# EAGLE design TwoMotorController 1.0 (EAGLE 6.6.0)
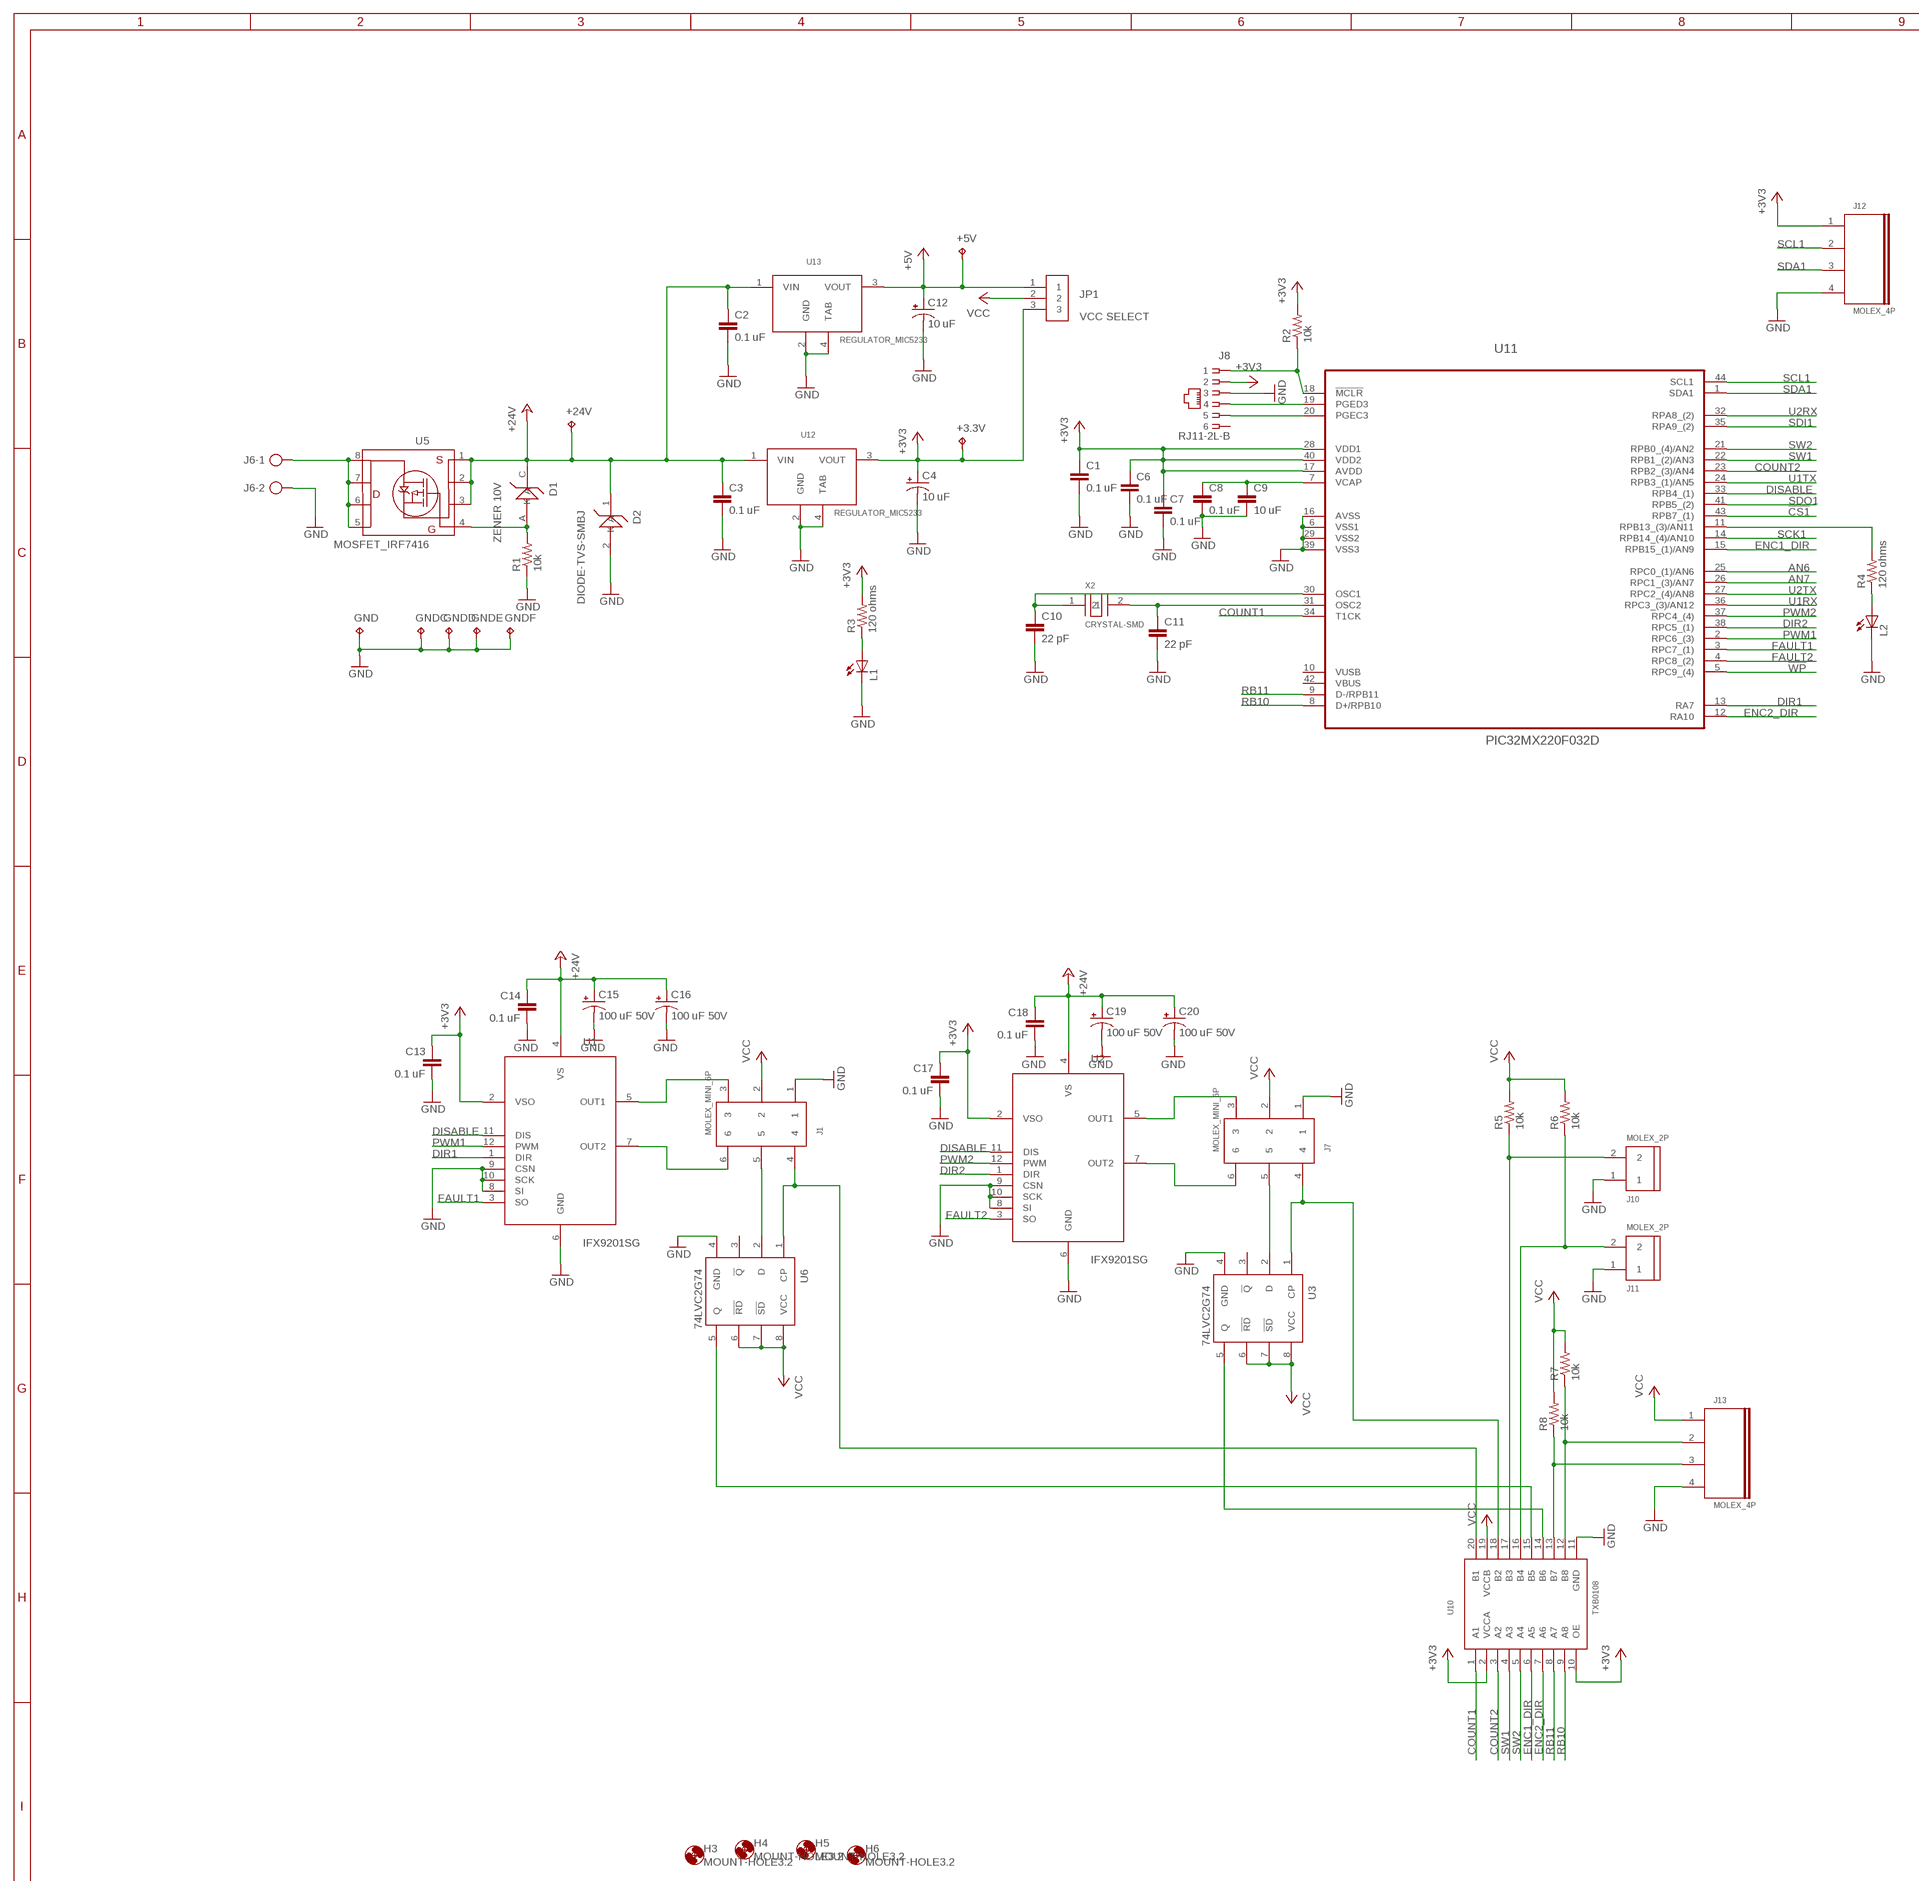
[diagram p0: schematic, sheet 1, part 1 of 2]
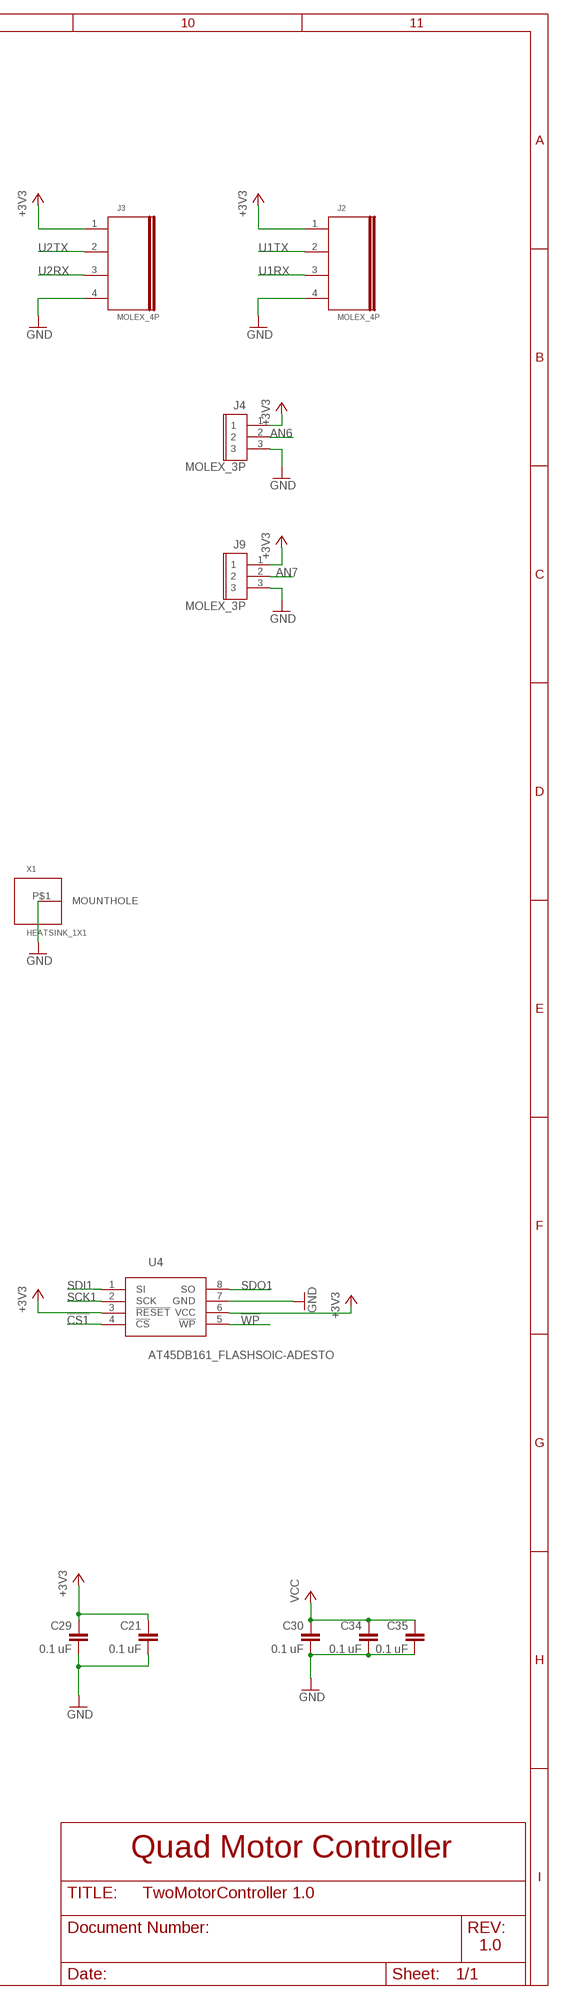
[diagram p1: schematic, sheet 1, part 2 of 2]

## Parts
+3.3V  TP  [TESTPAD]
+5V  TP  [TESTPAD]
+24V  TP  [TESTPAD]
C1  0.1 uF  C0805  [C0805]
C2  0.1 uF  C0805  [C0805]
C3  0.1 uF  C0805  [C0805]
C4  10 uF  POLCAPE2-5  [POLCAP_2MM]
C6  0.1 uF  C0805  [C0805]
C7  0.1 uF  C0805  [C0805]
C8  0.1 uF  C0805  [C0805]
C9  10 uF  C0805  [C0805]
C10  22 pF  C0805  [C0805]
C11  22 pF  C0805  [C0805]
C12  10 uF  POLCAPE2-5  [POLCAP_2MM]
C13  0.1 uF  C0805  [C0805]
C14  0.1 uF  C0805  [C0805]
C15  100 uF 50V  POLCAPE3.5-10  [E3,5-10]
C16  100 uF 50V  POLCAPE3.5-10  [E3,5-10]
C17  0.1 uF  C0805  [C0805]
C18  0.1 uF  C0805  [C0805]
C19  100 uF 50V  POLCAPE3.5-10  [E3,5-10]
C20  100 uF 50V  POLCAPE3.5-10  [E3,5-10]
C21  0.1 uF  C0805  [C0805]
C29  0.1 uF  C0805  [C0805]
C30  0.1 uF  C0805  [C0805]
C34  0.1 uF  C0805  [C0805]
C35  0.1 uF  C0805  [C0805]
D1  ZENER 10V  DIODE-ZENERDO-214AC  [DO-214AC]
D2  DIODE-TVS-SMBJ  [DIODE-TVS-SMBJ]
GND  TP  [TESTPAD]
GNDC  TP  [TESTPAD]
GNDD  TP  [TESTPAD]
GNDE  TP  [TESTPAD]
GNDF  TP  [TESTPAD]
H3  MOUNT-HOLE3.2  [3,2]
H4  MOUNT-HOLE3.2  [3,2]
H5  MOUNT-HOLE3.2  [3,2]
H6  MOUNT-HOLE3.2  [3,2]
J1  MOLEX_MINI_6P  [MOLEX_MINI_6P]
J2  MOLEX_4P  [MOLEX_4P]
J3  MOLEX_4P  [MOLEX_4P]
J4  MOLEX_3P  [MOLEX_3P]
J6  TRMBLOCK_5MM_2P  [TRMBLOCK_5MM_2P]
J7  MOLEX_MINI_6P  [MOLEX_MINI_6P]
J8  RJ11-2L-B  [RJ11-NO_SHIELD]
J9  MOLEX_3P  [MOLEX_3P]
J10  MOLEX_2P  [MOLEX_2P]
J11  MOLEX_2P  [MOLEX_2P]
J12  MOLEX_4P  [MOLEX_4P]
J13  MOLEX_4P  [MOLEX_4P]
JP1  VCC SELECT  JUMPER_3P  [JUMPER_3P]
L1  LED5MM  [LED5MM]
L2  LED5MM  [LED5MM]
R1  10k  RESISTORR0805  [R0805]
R2  10k  RESISTORR0805  [R0805]
R3  120 ohms  RESISTORR0805  [R0805]
R4  120 ohms  RESISTORR0805  [R0805]
R5  10k  RESISTORR0805  [R0805]
R6  10k  RESISTORR0805  [R0805]
R7  10k  RESISTORR0805  [R0805]
R8  10k  RESISTORR0805  [R0805]
U1  IFX9201SG  [IFX9201SG]
U2  IFX9201SG  [IFX9201SG]
U3  74LVC2G74  [TSSOP8]
U4  AT45DB161_FLASHSOIC-ADESTO  [SOIC-ADESTO]
U5  MOSFET_IRF7416  [SO-8-3.9MM]
U6  74LVC2G74  [TSSOP8]
U10  TXB0108  [TSSOP20]
U11  PIC32MX220F032D  [QFP80P1200X1200X120-44N]
U12  REGULATOR_MIC5233  [REGULATOR_MIC5233]
U13  REGULATOR_MIC5233  [REGULATOR_MIC5233]
X1  HEATSINK_1X1  [HEATSINK_1X1]
X2  CRYSTAL-SMD  [CRYSTAL-SMD]

## Nets
!CS1: U4.4(!CS) U11.43(RPB7_(1))
!WP: U4.5(!WP) U11.5(RPC9_(4))
+3V3: +3.3V.P$1(TP) C1.1 C4.+ C6.1 C7.1 C13.1 C17.1 C21.1 C29.1 J2.1 J3.1 J4.1 J8.2 J9.1 J12.1 JP1.3 R2.2 R3.2 U1.2(VSO) U2.2(VSO) U4.3(!RESET) U4.6(VCC) U10.2(VCCA) U10.10(OE) U11.17(AVDD) U11.28(VDD1) U11.40(VDD2) U12.3(VOUT)
+5V: +5V.P$1(TP) C12.+ JP1.1 U13.3(VOUT)
+24V: +24V.P$1(TP) C2.1 C3.1 C14.1 C15.+ C16.+ C18.1 C19.+ C20.+ D1.C(K) D2.1(K) U1.4(VS) U2.4(VS) U5.1 U5.2 U5.3 U12.1(VIN) U13.1(VIN)
AN6: J4.2 U11.25(RPC0_(1)/AN6)
AN7: J9.2 U11.26(RPC1_(3)/AN7)
COUNT1: U10.1(A1) U11.34(T1CK)
COUNT2: U10.3(A2) U11.23(RPB2_(3)/AN4)
DIR1: U1.1(DIR) U11.13(RA7)
DIR2: U2.1(DIR) U11.38(RPC5_(1))
DISABLE: U1.11(DIS) U2.11(DIS) U11.33(RPB4_(1))
ENC1_DIR: U10.6(A5) U11.15(RPB15_(1)/AN9)
ENC2_DIR: U10.7(A6) U11.12(RA10)
FAULT1: U1.3(SO) U11.3(RPC7_(1))
FAULT2: U2.3(SO) U11.4(RPC8_(2))
GND: C1.2 C2.2 C3.2 C4.- C6.2 C7.2 C8.2 C9.2 C10.2 C11.2 C12.- C13.2 C14.2 C15.- C16.- C17.2 C18.2 C19.- C20.- C21.2 C29.2 C30.2 C34.2 C35.2 D2.2(A) GND.P$1(TP) GNDC.P$1(TP) GNDD.P$1(TP) GNDE.P$1(TP) GNDF.P$1(TP) J1.1 J2.4 J3.4 J4.3 J6.2 J7.1 J8.3 J9.3 J10.1 J11.1 J12.4 J13.4 L1.K(C) L2.K(C) R1.1 U1.6(GND) U1.8(SI) U1.9(CSN) U1.10(SCK) U2.6(GND) U2.8(SI) U2.9(CSN) U2.10(SCK) U3.4(GND) U4.7(GND) U6.4(GND) U10.11(GND) U11.6(VSS1) U11.16(AVSS) U11.29(VSS2) U11.39(VSS3) U12.2(GND) U12.4(TAB) U13.2(GND) U13.4(TAB) X1.P$1(MOUNTHOLE)
N$1: J7.3 U2.5(OUT1)
N$2: C11.1 U11.31(OSC2) X2.2
N$3: C10.1 U11.30(OSC1) X2.1
N$4: J1.3 U1.5(OUT1)
N$5: J6.1 U5.5 U5.6 U5.7 U5.8
N$6: D1.A R1.2 U5.4
N$7: J1.6 U1.7(OUT2)
N$8: J1.5 U6.2(D)
N$9: U6.5(Q) U10.15(B5)
N$10: J8.1 R2.1 U11.18(!MCLR)
N$11: J8.4 U11.19(PGED3)
N$12: J8.5 U11.20(PGEC3)
N$13: C8.1 C9.1 U11.7(VCAP)
N$14: J7.6 U2.7(OUT2)
N$15: J7.5 U3.2(D)
N$16: U3.5(Q) U10.14(B6)
N$17: J10.2 R5.1 U10.17(B3)
N$18: J11.2 R6.1 U10.16(B4)
N$19: L2.A R4.1
N$20: R4.2 U11.11(RPB13_(3)/AN11)
N$22: J13.3 R8.1 U10.13(B7)
N$23: J13.2 R7.1 U10.12(B8)
N$29: L1.A R3.1
N$30: J1.4 U6.1(CP) U10.20(B1)
N$31: J7.4 U3.1(CP) U10.18(B2)
PWM1: U1.12(PWM) U11.2(RPC6_(3))
PWM2: U2.12(PWM) U11.37(RPC4_(4))
RB10: U10.9(A8) U11.8(D+/RPB10)
RB11: U10.8(A7) U11.9(D-/RPB11)
SCK1: U4.2(SCK) U11.14(RPB14_(4)/AN10)
SCL1: J12.2 U11.44(SCL1)
SDA1: J12.3 U11.1(SDA1)
SDI1: U4.1(SI) U11.35(RPA9_(2))
SDO1: U4.8(SO) U11.41(RPB5_(2))
SW1: U10.4(A3) U11.22(RPB1_(2)/AN3)
SW2: U10.5(A4) U11.21(RPB0_(4)/AN2)
U1RX: J2.3 U11.36(RPC3_(3)/AN12)
U1TX: J2.2 U11.24(RPB3_(1)/AN5)
U2RX: J3.3 U11.32(RPA8_(2))
U2TX: J3.2 U11.27(RPC2_(4)/AN8)
VCC: C30.1 C34.1 C35.1 J1.2 J7.2 J13.1 JP1.2 R5.2 R6.2 R7.2 R8.2 U3.6(!RD) U3.7(!SD) U3.8(VCC) U6.6(!RD) U6.7(!SD) U6.8(VCC) U10.19(VCCB)
Unconnected: J8.6 U3.3(!Q) U6.3(!Q) U11.10(VUSB) U11.42(VBUS)

## Notes on the sheet
- Quad Motor Controller
- 1.0

## Library data of the parts
+3.3V +5V +24V GND GNDC GNDD GNDE GNDF = JimLib:TP: Test pad
C1-C3 C6-C11 C13 C14 C17 C18 C21 C29 C30 C34 C35 = JimLib:C0805
C4 C12 C15 C16 C19 C20 = JimLib:POLCAP: POLARIZED CAPACITOR, American symbol
D1 = JimLib:DIODE-ZENER
D2 = JimLib:DIODE-TVS-SMBJ
H3-H6 = holes:MOUNT-HOLE: MOUNTING HOLE with drill center marker
J1 J7 = JimLib:MOLEX_MINI_6P
J2 J3 J12 J13 = JimLib:MOLEX_4P: .100" (2.54mm) Center Header - 3 Pin
J4 J9 = JimLib:MOLEX_3P
J6 = JimLib:TRMBLOCK_5MM_2P: CONNECTOR
J8 = JimLib:RJ11: CORCOM Modular RJ Jacks No Shield Source: www.tycoelectronics.com .. ENG_DS_1654001_1099_RJ_L_0507.pdf; MF: TYCO ELECTRONICS; MPN: RJ11-2L-B; OC_FARNELL: unknown; OC_NEWARK: 83F4463
J10 J11 = JimLib:MOLEX_2P
JP1 = JimLib:JUMPER_3P
L1 L2 = led:LED: LED OSRAM: - CHIPLED LG R971, LG N971, LY N971, LG Q971, LY Q971, LO R971, LY R971 LH N974, LH R974 LS Q976, LO Q976, LY Q976 LO Q996 - Hyper CHIPLED LW Q18S LB Q993, LB Q99A, LB R99A - SideLED LS A670, LO A670, LY A670, LG A670, LP A670 LB A673, LV A673, LT A673, LW A673 LH A674 LY A675 LS A676, LA A676, LO A676, LY A676, LW A676 LS A679, LY A679, LG A679 - Hyper Micro SIDELED® LS Y876, LA Y876, LO Y876, LY Y876 LT Y87S - SmartLED LW L88C, LW L88S LB L89C, LB L89S, LG L890 LS L89K, LO L89K, LY L89K LS L896, LA L896, LO L896, LY L896 - TOPLED LS T670, LO T670, LY T670, LG T670, LP T670 LSG T670, LSP T670, LSY T670, LOP T670, LYG T670 LG T671, LOG T671, LSG T671 LB T673, LV T673, LT T673, LW T673 LH T674 LS T676, LA T676, LO T676, LY T676, LB T676, LH T676, LSB T676, LW T676 LB T67C, LV T67C, LT T67C, LS T67K, LO T67K, LY T67K, LW E67C LS E67B, LA E67B, LO E67B, LY E67B, LB E67C, LV E67C, LT E67C LW T67C LS T679, LY T679, LG T679 LS T770, LO T770, LY T770, LG T770, LP T770 LB T773, LV T773, LT T773, LW T773 LH T774 LS E675, LA E675, LY E675, LS T675 LS T776, LA T776, LO T776, LY T776, LB T776 LHGB T686 LT T68C, LB T68C - Hyper Mini TOPLED® LB M676 - Mini TOPLED Santana® LG M470 LS M47K, LO M47K, LY M47K Source: http://www.osram.convergy.de LUXEON: - LUMILED® LXK2-PW12-R00, LXK2-PW12-S00, LXK2-PW14-U00, LXK2-PW14-V00 LXK2-PM12-R00, LXK2-PM12-S00, LXK2-PM14-U00 LXK2-PE12-Q00, LXK2-PE12-R00, LXK2-PE12-S00, LXK2-PE14-T00, LXK2-PE14-U00 LXK2-PB12-K00, LXK2-PB12-L00, LXK2-PB12-M00, LXK2-PB14-N00, LXK2-PB14-P00, LXK2-PB14-Q00 LXK2-PR12-L00, LXK2-PR12-M00, LXK2-PR14-Q00, LXK2-PR14-R00 LXK2-PD12-Q00, LXK2-PD12-R00, LXK2-PD12-S00 LXK2-PH12-R00, LXK2-PH12-S00 LXK2-PL12-P00, LXK2-PL12-Q00, LXK2-PL12-R00 Source: www.luxeon.com KINGBRIGHT: KA-3528ASYC Source: www.kingbright.com
R1-R8 = JimLib:RESISTOR: RESISTOR, American symbol
U1 U2 = JimLib:IFX9201SG: Infineon 6A H Bridge
U3 U6 = JimLib:74LVC2G74
U4 = JimLib:AT45DB161_FLASH
U5 = JimLib:MOSFET_IRF7416: MOSFET P-CH 30V 10A 8-SOIC IRF7416TRPBFCT-ND
U10 = JimLib:TXB0108
U11 = JimLib:PIC32MX220F032D: PIC32MX220F032D-I/PT 44-TQFP; MPN: PIC18F4550-I/PT; OC_FARNELL: 9321365; OC_NEWARK: 08J9633; PACKAGE: QFP-44; SUPPLIER: Microchip
U12 U13 = JimLib:REGULATOR_MIC5233
X1 = JimLib:HEATSINK_1X1: Ohmite #E3A-T220-25E 1" x 1" heatsink with #8-32 mounting hole DigiKey #E3A-T220-25E-ND
X2 = JimLib:CRYSTAL-SMD

## Board
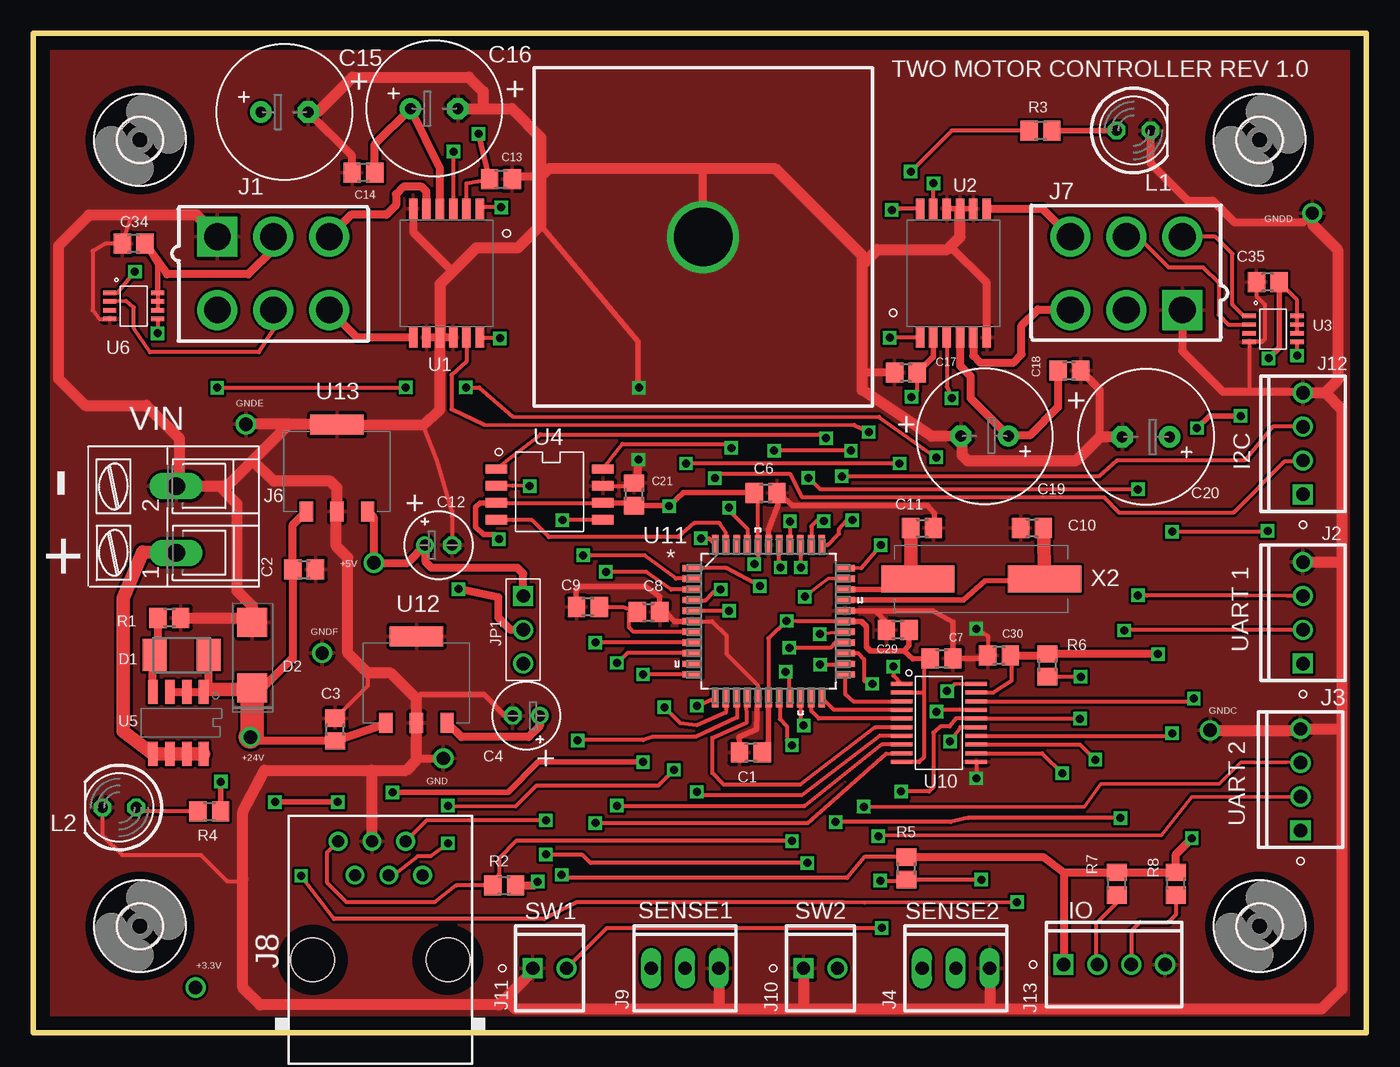
[diagram p2: board, top side]
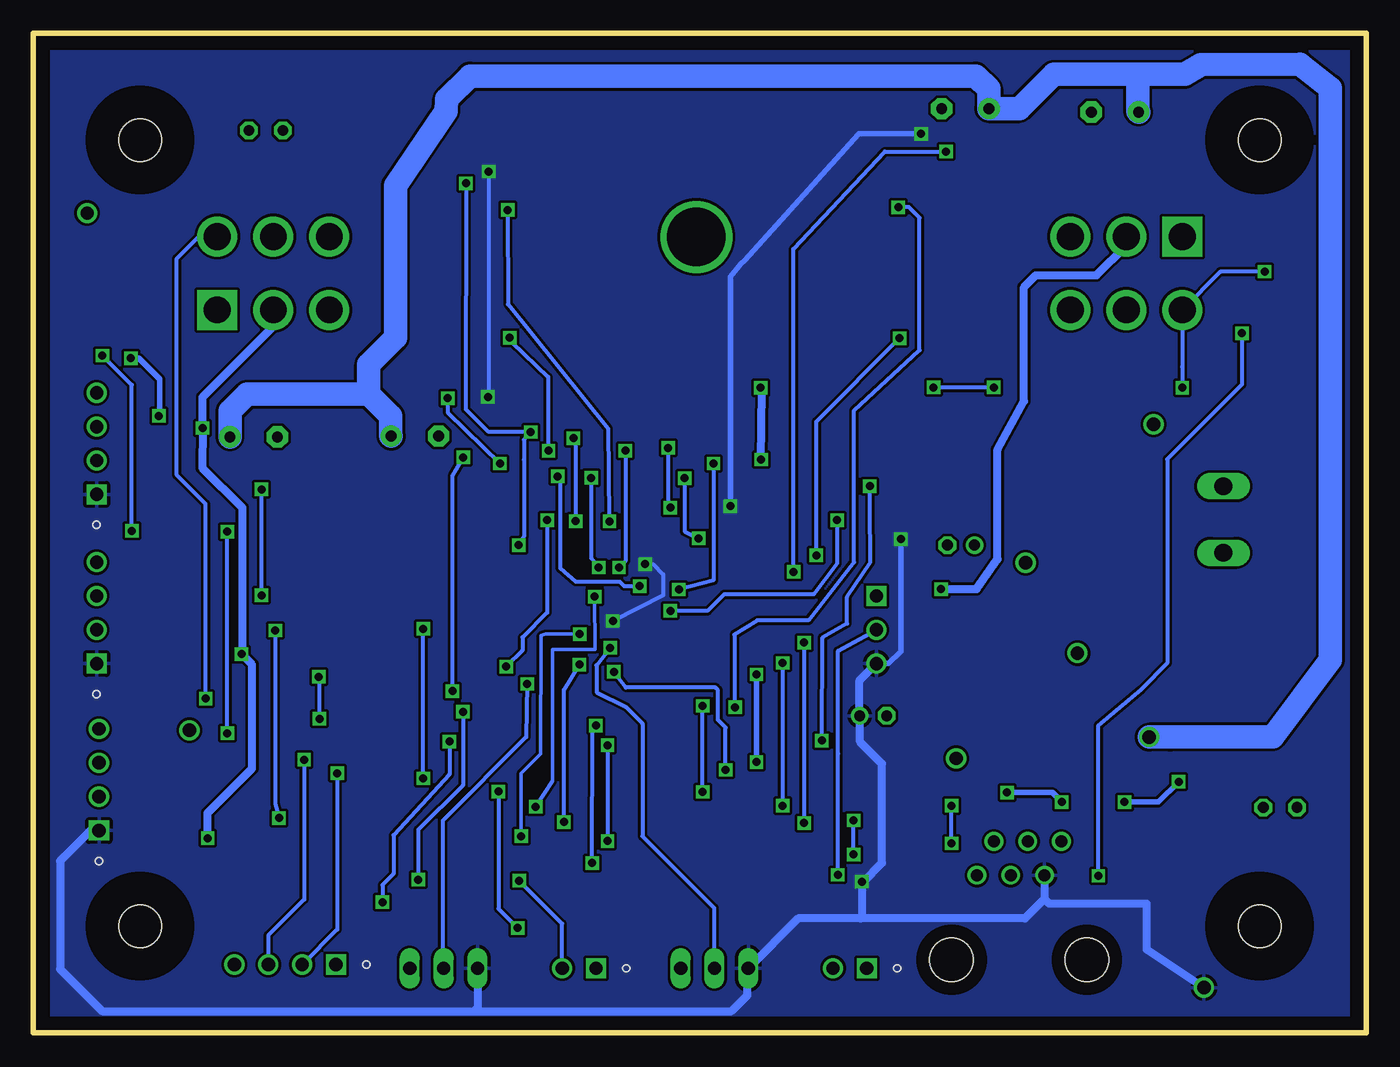
[diagram p3: board, bottom side, seen from below]

Size 100 x 75.03 mm. Coordinates in mm from the lower left corner, seen from the top.
Outline: 0,0.03 0,75.03 100,75.03 100,0.03 0,0.03
Copper layers (1*16): Top 0.035mm / dielectric 1.5mm / Bottom 0.035mm
Design rules "default *": minimum track width 10mil, minimum drill 22mil, track to track 8mil, track to pad 8mil, pad to pad 8mil, via to via 8mil, smd to smd 8mil, copper to edge 40mil, drill to drill 8mil, minimum pad ring 10mil, minimum via ring 8mil, stop-mask expansion 4mil, vias tented up to drill 0mil, thermal gap 10mil

### Footprints (pad centres in the part's own frame; a part is rotated, then mirrored left to right if it is on the bottom)
TESTPAD = drill 1: P$1 0,0
C0805 = smd 1.3 x 1.5: 1 -0.85,0; 2 0.85,0
POLCAP_2MM = drill 0.813 pad 1.27: + -1.016,0 | drill 0.813 pad 1.27 octagon: - 1.016,0
E3,5-10 = drill 0.813 pad 1.6: + -1.778,0 | drill 0.813 pad 1.6 octagon: - 1.778,0
DO-214AC = smd 1.8 x 2.4: A 2.025,0; C -2.025,0
DIODE-TVS-SMBJ = smd 2.16 x 2.26: 1 -2.45,0; 2 2.45,0
3,2 = hole 3.2: 0,0
MOLEX_MINI_6P = drill 2 square: 1 -4.2,2.75 | drill 2: 2 0,2.75; 3 4.2,2.75; 4 -4.2,-2.75; 5 0,-2.75; 6 4.2,-2.75
MOLEX_4P = drill 1 square: 1 -3.81,0 | drill 1: 2 -1.27,0; 3 1.27,0; 4 3.81,0
MOLEX_3P = drill 1 long: 1 -2.54,0; 2 0,0; 3 2.54,0
TRMBLOCK_5MM_2P = drill 1.321 long: 1 -1.854,-1.27; 2 3.15,-1.27
RJ11-NO_SHIELD = drill 0.9 pad 1.4: 1 -3.175,8.89; 2 -1.905,6.35; 3 -0.635,8.89; 4 0.635,6.35; 5 1.905,8.89; 6 3.175,6.35 | hole 3.251: -5.08,0; 5.08,0
MOLEX_2P = drill 1 square: 1 -1.27,0 | drill 1: 2 1.27,0
JUMPER_3P = drill 1 square: 1 -2.54,0 | drill 1: 2 0,0; 3 2.54,0
LED5MM = drill 0.813 octagon: A -1.27,0; K 1.27,0
R0805 = smd 1.3 x 1.5: 1 -0.85,0; 2 0.85,0
IFX9201SG = smd 0.635 x 1.524: 1 -2.5,-4.826; 2 -1.5,-4.826; 3 -0.5,-4.826; 4 0.5,-4.826; 5 1.5,-4.826; 6 2.5,-4.826; 7 2.5,4.826; 8 1.5,4.826; 9 0.5,4.826; 10 -0.5,4.826; 11 -1.5,4.826; 12 -2.5,4.826
TSSOP8 = smd 0.33 x 1: 1 -0.975,-1.8; 2 -0.325,-1.8; 3 0.325,-1.8; 4 0.975,-1.8; 5 0.975,1.8; 6 0.325,1.8; 7 -0.325,1.8; 8 -0.975,1.8
SOIC-ADESTO = smd 0.7 x 1.6: 1 -1.27,-4; 2 0,-4; 3 1.27,-4; 4 2.54,-4; 5 2.54,4; 6 1.27,4; 7 0,4; 8 -1.27,4
SO-8-3.9MM = smd 0.72 x 1.8: 1 -1.905,-2.34; 2 -0.635,-2.34; 3 0.635,-2.34; 4 1.905,-2.34; 5 1.905,2.34; 6 0.635,2.34; 7 -0.635,2.34; 8 -1.905,2.34
TSSOP20 = smd 0.3 x 1.6: 1 -2.925,-2.8; 2 -2.275,-2.8; 3 -1.625,-2.8; 4 -0.975,-2.8; 5 -0.325,-2.8; 6 0.325,-2.8; 7 0.975,-2.8; 8 1.625,-2.8; 9 2.275,-2.8; 10 2.925,-2.8; 11 2.925,2.8; 12 2.275,2.8; 13 1.625,2.8; 14 0.975,2.8; 15 0.325,2.8; 16 -0.325,2.8; 17 -0.975,2.8; 18 -1.625,2.8; 19 -2.275,2.8; 20 -2.925,2.8
QFP80P1200X1200X120-44N = smd 1.473 x 0.483: 1 -5.74,3.988; 2 -5.74,3.2; 3 -5.74,2.388; 4 -5.74,1.6; 5 -5.74,0.787; 6 -5.74,0; 7 -5.74,-0.787; 8 -5.74,-1.6; 9 -5.74,-2.388; 10 -5.74,-3.2; 11 -5.74,-3.988; 23 5.74,-3.988; 24 5.74,-3.2; 25 5.74,-2.388; 26 5.74,-1.6; 27 5.74,-0.787; 28 5.74,0; 29 5.74,0.787; 30 5.74,1.6; 31 5.74,2.388; 32 5.74,3.2; 33 5.74,3.988 | smd 0.483 x 1.473: 12 -3.988,-5.74; 13 -3.2,-5.74; 14 -2.388,-5.74; 15 -1.6,-5.74; 16 -0.787,-5.74; 17 0,-5.74; 18 0.787,-5.74; 19 1.6,-5.74; 20 2.388,-5.74; 21 3.2,-5.74; 22 3.988,-5.74; 34 3.988,5.74; 35 3.2,5.74; 36 2.388,5.74; 37 1.6,5.74; 38 0.787,5.74; 39 0,5.74; 40 -0.787,5.74; 41 -1.6,5.74; 42 -2.388,5.74; 43 -3.2,5.74; 44 -3.988,5.74
REGULATOR_MIC5233 = smd 1 x 1.5: 1 -2.3,0; 2 0,0; 3 2.3,0 | smd 4 x 1.5: 4 0,6.5
HEATSINK_1X1 = drill 4.394: P$1 0,0
CRYSTAL-SMD = smd 5.5 x 2: 1 -4.75,0; 2 4.75,0

### Placement (x,y rotation side)
+3.3V  12.17,3.43 0 top
+5V  25.55,35.3 0 top
+24V  16.28,22.22 0 top
C1  53.83,21.07 180 top
C2  20.32,34.8 0 top
C3  22.65,22.78 90 top
C4  36.99,23.82 180 top
C6  54.94,40.53 0 top
C7  68.14,28.11 0 top
C8  46.15,31.59 0 top
C9  41.61,31.98 180 top
C10  74.93,37.9 180 top
C11  66.67,37.9 0 top
C12  30.4,36.62 0 top
C13  35.08,64.08 0 top
C14  24.77,64.56 180 top
C15  18.85,69.12 0 top
C16  30.07,69.38 0 top
C17  65.47,49.56 180 top
C18  77.72,49.72 0 top
C19  71.38,44.81 180 top
C20  83.47,44.75 180 top
C21  45.09,40.44 90 top
C29  64.85,30.27 180 top
C30  72.46,28.34 180 top
C34  7.53,59.25 180 top
C35  92.61,56.36 180 top
D1  11.13,28.37 180 top
D2  16.43,28.37 90 top
GND  30.76,20.62 0 top
GNDC  88.29,22.73 0 top
GNDD  95.96,61.54 0 top
GNDE  15.95,45.69 0 top
GNDF  21.67,28.52 0 top
H3  8,8.03 0 top
H4  92,8.03 0 top
H5  8,67.03 0 top
H6  92,67.03 0 top
J1  18,57.03 0 top
J2  95.25,31.55 90 top
J3  95.07,19.02 90 top
J4  69.22,4.88 0 top
J6  9.45,37.9 90 top
J7  82,57.03 180 top
J8  26.04,5.51 0 top
J9  48.9,4.88 0 top
J10  59.05,4.88 0 top
J11  38.73,4.88 0 top
J12  95.25,44.25 90 top
J13  81.1,5.15 0 top
JP1  36.75,30.27 270 top
L1  82.55,67.74 0 top
L2  6.45,16.94 180 top
R1  10.21,31.16 180 top
R2  35.33,11.1 0 top
R3  75.56,67.74 180 top
R4  13.21,16.64 0 top
R5  65.51,12.37 90 top
R6  76.1,27.61 90 top
R7  81.28,11.23 90 top
R8  85.72,11.23 90 top
U1  31,57.03 180 top
U2  69.03,57.03 0 top
U3  93.02,52.85 270 top
U4  38.73,41.07 270 top
U5  10.88,23.29 180 top
U6  7.53,54.58 270 top
U10  67.94,23.29 270 top
U11  55.16,30.91 0 top
U12  28.75,23.29 0 top
U13  22.78,39.17 0 top
X1  50.25,59.75 0 top
X2  71.12,34.09 180 top

### Tracks (layer width: path | path; a pad name or v marks a point on that pad's centre or on a via)
!CS1
  Top 0.305: U11.43 51.97,37.57 51.49,38.28 49.58,38.28 48.39,37.23 38.68,37.23 37.41,38.51 36.03,38.51 U4.4
!WP  (via drill 0.6)
  Top 0.305: U4.5 39.73,38.53 v39.7,38.51 | v52.2,31.7 U11.5
  Bottom 0.305: v39.7,38.51 39.7,35.25 41.45,32.94 48.18,32.94 U11.5 v52.2,31.7
+3V3  (via drill 0.6)
  Top 0.305: U1.2 32.5,63.78 C13.1 | U4.3 U4.6 | C7.1 66.81,27.7 66.8,26.64 66.8,25.58 | 66.8,25.58 66.8,20.7 66.45,20.34 65.17,20.34 U10.10 | U10.2 66.79,25.56 66.8,25.58 | U11.28 57.35,30.91 v56.52,30.94 55.14,29.64 55.14,25.19 U11.17 | v54.1,35.2 54.38,35.48 U11.40 54.38,40.25 C6.1 | R3.2 68.91,67.74 v65.84,64.67 | v65.89,47.75 65.89,47.78 66.32,48.21 C17.1
  Top 0.406: v33.4,67.49 33.72,66.19 C13.1 | U2.2 67.53,50.76 C17.1 | C6.1 53.51,40.59 48.77,40.59 v47.7,39.55 47.51,39.59 C21.1 44.87,39.8 U4.6 | U11.28 62.13,30.91 62.51,30.53 62.51,28.98 62.79,28.7 65.3,28.7 | 65.3,28.7 65.71,29.11 C29.1 | C7.1 65.99,28.09 65.3,28.7 | U11.17 55.16,21.91 C1.1 | U4.3 33.5,39.8 33.2,39.5 33.2,38 33.78,37.41 34.59,37.41 v34.92,37.08
  Top 0.61: C4.+ 38,23.06 37.16,22.22 32.12,22.22 U12.3 | R2.2 37.57,11.1 v37.85,11.38
  Bottom 0.305: v54.1,35.2 53.52,35.2 52.76,34.44 52.76,32.87 v56.52,30.94 | v65.84,64.67 65.84,47.8 v65.89,47.75
  Bottom 0.406: v47.7,39.55 47.7,56.77 46.91,57.73 46.66,57.99 38.08,67.49 v33.4,67.49 | v34.92,37.08 34.92,28.65 35.84,27.73 JP1.3
  Bottom 0.61: J3.1 95.71,15.21 97.99,12.93 97.99,4.8 94.84,1.65 66.93,1.65 | 66.93,1.65 47.62,1.65 46.43,2.84 46.43,4.8 J9.1 42.62,8.61 37.92,8.61 | J4.1 66.67,1.9 66.93,1.65 | JP1.3 38,26.48 C4.+ 37.97,23.79 37.97,21.87 36.32,20.22 36.32,12.77 37.72,11.38 v37.85,11.38 37.85,8.69 37.92,8.61 | J8.2 24.13,10.08 | 24.13,10.08 25.6,8.61 37.92,8.61 | +3.3V.P$1 16.46,6.27 16.46,9.73 23.77,9.73 24.13,10.08
  pour Bottom: 0.64,74.09 99.06,74.09 99.06,1.07 0.64,1.07
+5V
  Top 0.61: U13.3 25.55,38.69 +5V.P$1 28.06,35.3 C12.+ 29.44,36.57 29.44,35.36 29.87,34.92 36.32,34.92 36.75,34.5 JP1.1
+24V
  Top 0.61: U5.3 U5.2 U5.1 13.16,25.81 D1.C | U12.1 26.36,23.2 C3.1 16.57,21.93 +24V.P$1 | U2.4 69.53,50.08 70.31,49.3 70.31,47.66 C19.+ 73.2,44.86 74.75,44.86 76.88,46.98 C18.1 | C14.1 25.61,66.69 C16.+ 30.5,64.89 U1.4 | U13.1 19.47,38.16 C2.1 19.47,28.16 17.07,25.75 16.6,25.75 D2.1
  Top 1.016: 13.16,25.81 16.32,25.81 D2.1
  Top 1.778: D2.1 16.43,22.37 +24V.P$1
  Bottom 1.778: C15.+ 17.14,69.19 17.14,71.63 16.82,71.96 | C20.+ 85.25,46.68 83.97,47.95 74.83,47.95 | 74.83,47.95 73.18,46.3 73.18,44.83 C19.+ | 74.83,47.95 74.83,50.19 72.82,52.2 72.82,63.6 69.04,69.19 68.99,70.08 67.23,71.83 29.29,71.83 28.32,70.86 28.32,69.4 C16.+ 26.03,69.38 23.44,71.96 16.82,71.96 | 16.82,71.96 13.61,71.96 12.42,72.67 4.98,72.72 2.69,70.92 2.69,28.01 7.01,22.25 14.71,22.22 +24V.P$1
AN6  (via drill 0.6)
  Top 0.305: U11.25 61.87,28.52 62.33,28.06 62.33,26.44 v62.94,26.21
  Bottom 0.305: v62.94,26.21 63.02,22.22 69.29,15.95 69.29,4.95 J4.2
AN7  (via drill 0.6)
  Top 0.305: U11.26 60.17,29.31 59.79,28.93 v56.72,28.93
  Bottom 0.305: v56.72,28.93 57.76,27.61 57.73,25.58 55.55,24.48 54.3,23.24 54.3,14.78 48.92,9.4 48.92,4.9 J9.2
COUNT1  (via drill 0.6)
  Top 0.305: U11.34 59.61,36.65 60.45,37.49 60.45,37.82 61.06,38.51 v61.44,38.51 | v64.52,27.51 64.52,26.84 U10.1
  Bottom 0.305: v61.44,38.51 61.44,31.57 63.3,29.72 63.3,28.73 v64.52,27.51
COUNT2
  Top 0.305: U11.23 60.91,25.45 61.52,24.92 U10.3
DIR1  (via drill 0.6)
  Top 0.305: U11.13 51.97,24.07 49.76,23.11 48.54,23.27 v47.35,24.46 | v35.1,61.97 33.62,61.97 U1.1
  Bottom 0.305: v35.1,61.97 35.08,62 34.31,62 33.5,61.19 33.5,51.25 38.43,46.73 38.43,35.36 41.86,30.99 45.67,30.99 47.4,29.92 47.4,24.64 v47.35,24.46
DIR2  (via drill 0.6)
  Top 0.305: U2.1 65.39,52.2 v64.26,52.2 | v61.34,43.71 v55.58,43.71 | v56.06,34.95 56.06,35.36 55.93,35.48 55.93,36.63 U11.38
  Bottom 0.305: v64.26,52.2 64.14,51.86 61.37,49.25 61.37,43.74 v61.34,43.71 | v55.58,43.71 55.58,35.43 v56.06,34.95
DISABLE  (via drill 0.6)
  Top 0.305: U2.11 67.53,63.53 v67.54,63.78 | v63.58,36.62 62.1,34.88 U11.33 | U1.11 32.5,50.41 31.37,49.4 31.37,46.84 33.81,45.67 61.57,45.64 v62.69,45.11
  Bottom 0.305: v67.54,63.78 67.56,46.89 67.56,46.84 65.89,45.16 62.74,45.16 v62.69,45.11 63.07,44.73 63.18,44.51 63.2,43.03 63.2,37.26 v63.58,36.62
ENC1_DIR
  Top 0.305: U10.6 63.15,22.94 57.53,18.64 51.82,18.64 50.95,19.53 50.95,22.17 53.54,23.34 53.52,25.12 U11.15
ENC2_DIR  (via drill 0.6)
  Top 0.305: U10.7 63.52,22.31 57.66,17.85 49.94,17.85 v49.78,18.11 | v49.78,24.56 U11.12
  Bottom 0.305: v49.78,18.11 v49.78,24.56
FAULT1  (via drill 0.6)
  Top 0.305: U11.3 47.85,33.3 45.97,34.62 v42.95,34.62 | U1.3 31.52,61.88 v31.52,66.17
  Bottom 0.305: v42.95,34.62 42.98,58.85 36.12,66.17 v31.52,66.17
FAULT2  (via drill 0.6)
  Top 0.305: U2.3 68.53,48.51 v68.91,47.65 | v65,42.75 v48.97,42.75 | U11.4 49.45,32.48 50.42,32.48 51.03,33.09 51.36,33.09 v51.56,33.3
  Bottom 0.305: v68.91,47.65 68.91,46.58 v65,42.75 | v48.97,42.75 48.97,33.98 v51.56,33.3
GND  (via drill 0.6)
  Top 0.305: U4.7 45,41.05 C21.2 | 55.88,40.82 55.88,39.99 C6.2 | 91.39,48.13 91.22,48.3 U3.4 91.23,51.89 92.2,51.89 92.41,52.09 92.41,54.68 91.77,55.33 C35.2 | U6.4 5.71,53.59 4.95,53.59 4.45,54.25 4.45,58.7 5.4,59.25 C34.2 7.31,61.09 7.01,61.39 | U10.11 70.75,19.54 v70.74,19.12 | v70.74,30.35 71.63,29.8 C30.2 | L2.K 5.18,14.86 6.66,13.38 12.57,13.38 14.55,11.4 15.54,11.4 15.72,11.58 | 25.09,27.02 25.09,26.07 C3.2 | 29.26,45.64 30.28,42.97 31.42,39.17 31.42,38.81 C12.- | U11.6 50.93,30.91 51.99,29.84 51.99,28.47 54.36,26.11 54.36,25.19 U11.16
  Top 0.406: 28.78,20.62 28.75,20.65 | C4.- 35.41,23.82 33.81,25.42 29.1,25.42 28.75,25.07 | 55.88,40.82 55.88,39.62 55.14,37.74 55.14,36.67 U11.39 | U11.6 48.11,30.91 47.42,31.59 C8.2 46.97,31.28 46.97,32.76 45.92,33.53 41,33.53 40.72,33.25 40.72,31.98 | 38.08,60.65 45.38,51.9 45.38,48.5 v45.44,48.44 | U2.10 U2.9 U2.8 | C29.2 64,30.84 63.17,31.67 | 63.17,31.67 63.14,31.7 U11.29 | 63.17,31.67 63.2,31.7 67.49,31.7 68.99,30.85 C7.2 71.56,28.11 C30.2 | 56.1,40.21 56.29,40.21 56.95,39.6 67.08,39.6 67.61,39.01 67.61,37.98 C11.2 | U11.16 54.31,25.11 54.24,22.82 52.96,22.22 52.98,21.71 C1.2
  Top 0.61: U1.10 U1.9 U1.8 | J7.1 86.2,51.19 89.26,48.13 91.39,48.13 95.17,48.13 J12.4 | C9.2 40.72,31.98 | U1.6 28.5,60.12 31.46,57.16 | C14.2 23.91,65.83 C15.- | 80,44.75 80,48.29 C18.2 | C17.2 62.33,49.56 62.2,49.43 | X1.P$1 50.25,64.83 50.22,64.87 | U2.6 71.53,56.31 68.81,59.03 | 38.08,64.29 36.05,64.29 C13.2 | L1.K 83.82,65.28 86.61,62.48 88.49,62.48 90.12,60.86 95.28,60.86 GNDD.P$1 | 45,41.05 45.38,41.79 v45.39,43.05 | 28.78,20.62 GND.P$1
  Top 0.813: 13.97,41.05 J6.2 10.95,41.28 10.95,44.65 8.48,47.11 3.89,47.11 1.88,49.12 1.88,59.08 4.19,61.39 7.01,61.39 12.24,61.39 13.8,59.83 J1.1 | 13.97,41.05 14.53,41.05 16.47,42.99 | 16.47,42.99 19.18,45.69 | 19.18,45.69 22.75,45.69 U13.4 29.26,45.64 30.5,46.81 U1.9 30.5,56.21 31.46,57.16 33.22,58.93 36.35,58.93 38.08,60.65 38.08,64.29 | C16.- 33.93,69.38 | 33.93,69.38 35.91,69.38 38.08,67.21 38.08,64.29 | C15.- 21.32,69.12 23.95,71.75 32.66,71.75 33.76,70.66 33.76,69.55 33.93,69.38 | 62.2,57.68 62.2,49.43 62.2,48.26 67.41,44.78 C19.- 69.7,44.71 69.7,43.36 70.1,42.95 78.21,42.95 80,44.75 C20.- | 62.2,57.68 63.32,58.8 68.58,58.8 68.81,59.03 69.52,59.74 U2.9 | 62.2,57.68 62.2,58.34 55.68,64.87 50.22,64.87 38.66,64.87 38.08,64.29 | J11.1 37.47,4.65 35.41,2.59 | 35.41,2.59 34.95,2.13 17.02,2.13 15.72,3.43 15.72,11.58 15.72,16.61 17.35,19.73 25.4,19.73 | 25.4,19.73 27.99,19.73 28.75,20.52 28.75,20.65 U12.2 28.75,25.07 26.8,27.02 25.09,27.02 23.6,28.52 23.6,35.69 22.73,36.55 22.73,39.12 U13.2 22.78,40.92 22.28,41.43 18.03,41.43 16.47,42.99 | J12.4 96.93,48.06 | 96.93,48.06 98.17,46.81 98.17,35.51 | 98.17,35.51 98.17,22.91 | 98.17,22.91 98.17,3.33 96.65,1.8 71.55,1.8 | 71.55,1.8 57.76,1.8 | 57.76,1.8 51.71,1.8 | 51.71,1.8 36.2,1.8 35.41,2.59 | J9.3 51.44,2.08 51.71,1.8 | J10.1 57.78,1.83 57.76,1.8 | J4.3 71.75,2.01 71.55,1.8 | 98.17,22.91 98.09,22.83 J3.4 94.97,22.73 GNDC.P$1 | J2.4 98.02,35.36 98.17,35.51 | R1.1 16.09,31.16 D2.2 16.43,32.06 15.29,33.2 15.29,39.72 13.97,41.05 | 56.1,40.21 C6.2 | GNDD.P$1 95.96,60.7 97.87,58.8 97.87,49 96.93,48.06 | 19.18,45.69 GNDE.P$1 | J8.3 25.4,19.73
  Bottom 0.305: v70.74,19.12 v70.74,30.35
  Bottom 0.61: v45.39,43.05 45.34,48.18 v45.44,48.44
  pour Top: 0.64,74.09 99.06,74.09 99.06,1.07 0.64,1.07
N$1
  Top 0.61: U2.5 70.53,50.83 71.02,50.34 73.56,50.34 74.14,50.92 74.14,53.08 75.36,54.3 77.78,54.3 J7.3
N$2
  Top 0.406: U11.31 65.73,33.3 X2.2
  Top 1.016: C11.1 65.83,34.18 X2.2
N$3
  Top 0.406: U11.30 69.77,32.51 71.4,33.93 75.11,33.96 X2.1
  Top 1.016: X2.1 75.82,37.75 C10.1
N$4
  Top 0.61: U1.5 29.5,63.16 29.13,63.52 27.76,63.52 27.2,62.97 27.2,62.13 26.49,61.42 23.84,61.42 J1.3
N$5
  Top 1.016: J6.1 8.2,36.12 6.76,32.66 6.76,22.63 U5.5 U5.6 U5.7 U5.8
N$6
  Top 0.61: R1.2 9.31,28.6 D1.A 8.99,28.67 U5.4
N$7
  Top 0.61: U1.7 24.28,52.2 J1.6
N$8
  Top 0.305: J1.5 18,52.77 16.92,51.1 8.76,51.1 7.54,52.91 7.54,54.46 6.96,54.94 U6.2
N$9  (via drill 0.6)
  Top 0.305: U6.5 v9.32,52.53 | U10.15 69.55,22.97 v68.78,21.89 | v73.81,9.83 62.36,9.8 60.76,9.83 40.77,9.83 38.33,8.58 22.55,8.58 v20.09,11.81
  Bottom 0.305: v9.32,52.53 9.32,48.69 14.94,43.08 14.94,27.79 16.87,25.8 20.09,23.11 v20.09,11.81 | v68.78,21.89 68.78,19.43 72.97,14.86 72.97,11.96 73.81,11.12 v73.81,9.83
N$10  (via drill 0.6)
  Top 0.305: U11.18 55.95,25.12 56.01,25.07 56.01,23.57 56.54,23.04 56.54,22 v56.92,21.61 | J8.1 22.05,13.59 22.05,11.28 23.5,9.83 30.12,9.83 31.73,11.1 R2.1 34.92,11.92 34.92,13.13 36.22,14.43 v56.92,14.43
  Bottom 0.305: v56.92,21.61 v56.92,14.43
N$11  (via drill 0.6)
  Top 0.305: J8.4 27,11.86 28.85,13.31 29.82,13.31 v31.11,14.25 | v31.11,17.07 36.2,17.04 37.74,18.59 46.89,18.59 v48.06,19.76 | U11.19 56.74,25.19 56.74,26.82 v56.44,27.12
  Bottom 0.305: v31.11,14.25 v31.11,17.07 | v48.06,19.76 48.06,22.93 48.64,23.52 48.64,25.75 48.82,25.93 55.55,25.93 v56.44,27.12
N$12  (via drill 0.6)
  Top 0.305: U11.20 57.56,23.31 v57.78,23.09 | v58.06,12.77 41.81,12.77 41.2,13.38 38.48,13.38 v38.46,13.41 | v38.46,15.98 29.52,15.98 J8.5
  Bottom 0.305: v58.06,12.77 58.04,22.71 v57.78,23.09 | v38.46,13.41 v38.46,15.98
N$13
  Top 0.305: U11.7 45.03,30.12 44.7,30.45 44.7,31.56 C8.1 44.28,31.98 C9.1
N$14
  Top 0.61: U2.7 75.72,61.86 J7.6
N$15
  Top 0.305: J7.5 82.86,59.78 85.17,57.48 87.76,57.48 88.92,56.31 88.92,53.92 89.66,53.16 U3.2
N$16  (via drill 0.6)
  Top 0.305: U10.14 85.26,22.31 v85.45,22.5 | v85.45,37.64 92.51,37.64 v92.61,37.69 | v94.82,50.85 U3.5
  Bottom 0.305: v85.45,22.5 v85.45,37.64 85.39,37.54 | v92.61,37.69 92.61,48.64 v94.82,50.85
N$17  (via drill 0.6)
  Top 0.305: U10.17 68.06,24.27 v67.77,24.13 | v71.12,11.53 R5.1 65.44,11.45 v63.55,11.45
  Bottom 0.305: v67.77,24.13 67.77,18.62 71.12,15.26 v71.12,11.53 | J10.2 60.33,8.23 v63.55,11.45
N$18  (via drill 0.6)
  Top 0.305: v65.1,18.13 67.21,18.13 67.51,18.44 67.51,22.55 68.07,23.01 68.73,23.01 69.23,23.62 U10.16 78.52,23.62 v78.54,23.59 | J11.2 43.03,7.9 v63.65,7.9 | v78.59,26.74 76.11,26.74 R6.1
  Bottom 0.305: v65.1,18.13 65.1,9.34 v63.65,7.9 | v78.54,23.59 78.54,26.69 v78.59,26.74
N$19
  Top 0.305: R4.1 8.03,16.63 L2.A
N$20  (via drill 0.6)
  Top 0.305: U11.11 v45.74,26.92
  Top 0.406: v45.74,20.34 37.87,20.34 35.61,18.08 26.98,18.08 v26.95,18.06 | v22.84,17.35 v18.14,17.35 | v14.07,18.87 14.07,16.65 R4.2
  Bottom 0.406: v45.74,26.92 v45.74,20.34 | v26.95,18.06 23.55,18.06 v22.84,17.35 | v18.14,17.35 15.6,17.35 v14.07,18.87
N$22  (via drill 0.6)
  Top 0.305: U10.13 78.54,21.66 v79.68,20.52 | J13.3 82.37,7.67 83.03,8.33 85.14,8.33 85.75,8.94 85.75,10.35 R8.1
  Bottom 0.305: v79.68,20.52 79.68,10.03 82.37,7.34 J13.3
N$23  (via drill 0.6)
  Top 0.305: U10.12 75.68,21.02 v77.19,19.51 | R7.1 81.28,9.8 79.7,8.23 79.7,5.28 J13.2
  Bottom 0.305: v77.19,19.51 77.19,7.8 J13.2
N$29
  Top 0.406: R3.1 L1.A
N$30  (via drill 0.6)
  Top 0.305: U10.20 69.11,26.19 v68.56,25.68 | v13.79,48.44 27.94,48.44 v27.94,48.46 | v32.46,48.46 33.45,48.46 35.94,46.28 63.45,46.25 66.78,43.86 67.59,43.31 v67.74,43.2 | U6.1 6.33,55.56 v7.62,57.15
  Bottom 0.305: v68.56,25.68 68.56,41.83 v67.74,43.2 | v13.79,48.44 13.8,50 J1.4 10.93,57.15 v7.62,57.15 | v27.94,48.46 v32.46,48.46 32.46,48.49
N$31  (via drill 0.6)
  Top 0.305: U3.1 90.83,53.83 89.97,54.68 89.97,58.49 88.7,59.76 86.22,59.76 J7.4 | U10.18 86.87,24.91 v87.07,25.12
  Bottom 0.305: v87.07,25.12 87.07,39.72 89.23,41.88 89.23,58.14 87.61,59.76 86.22,59.76 J7.4
PWM1  (via drill 0.6)
  Top 0.305: U11.2 48.21,34.11 45.87,35.86 v41.25,35.86 | v35,52.14 33.56,52.14 U1.12
  Bottom 0.305: v41.25,35.86 41.25,45.9 v35,52.14
PWM2  (via drill 0.6)
  Top 0.305: U2.12 64.98,61.86 v64.41,61.77 | v56.77,38.4 U11.37
  Bottom 0.305: v64.41,61.77 64.39,54.71 56.87,45.36 56.82,38.58 v56.77,38.4
RB10  (via drill 0.6)
  Top 0.305: v42.16,15.77 58.12,15.77 63.98,20.98 U10.9 | U11.8 v42.16,29.31
  Bottom 0.305: v42.16,29.31 v42.16,15.77
RB11  (via drill 0.6)
  Top 0.305: U10.8 63.65,21.66 57.89,17.07 v43.79,17.07 | U11.9 44.58,28.52 v43.79,27.79
  Bottom 0.305: v43.79,27.79 v43.79,17.07
SCK1  (via drill 0.6)
  Top 0.305: U11.14 52.8,23.69 49.68,22.25 46.46,22.25 45.77,22 40.69,22 v40.84,21.97 | v37.24,41.05 35.98,41.09 U4.2
  Bottom 0.305: v40.84,21.97 40.79,29.69 38.94,30.73 38.94,32.74 37.21,35.33 37.24,39.57 v37.24,41.05
SCL1  (via drill 0.6)
  Top 0.305: v51.13,41.65 51.44,41.96 56.79,41.96 57.68,40.23 80.31,40.23 81.46,39.09 90.07,39.09 93.9,42.92 95.2,42.92 J12.2 | v50.09,37.13 50.7,37.13 U11.44
  Bottom 0.305: v51.13,41.65 51.13,37.67 v50.09,37.13
SDA1  (via drill 0.6)
  Top 0.305: J12.3 92.99,45.52 90.91,42.97 81.31,42.97 79.93,41.78 v60.66,41.78 | v54.51,33.55 51.99,34.9 U11.1
  Bottom 0.305: v60.66,41.78 60.48,41.27 60.48,34.9 59.31,33.88 56.01,33.88 55.68,33.55 v54.51,33.55
SDI1  (via drill 0.6)
  Top 0.305: U4.1 36.01,43.34 38.05,44.93 58.95,44.93 v59.49,44.65 | 58.32,36.7 U11.35 58.37,38.05 58.75,38.43 v59.31,38.43
  Bottom 0.305: v59.49,44.65 59.31,44.47 v59.31,38.43
SDO1  (via drill 0.6)
  Top 0.305: U4.8 43.62,43.47 44.2,44.22 52.32,44.22 v52.38,43.92 | v52.2,39.44 52.22,39.19 53.57,37.84 U11.41
  Bottom 0.305: v52.38,43.92 52.38,39.72 v52.2,39.44
SW1
  Top 0.305: U10.4 60.06,24.27 U11.22
SW2
  Top 0.305: U10.5 58.93,23.62 58.37,24.18 U11.21
U1RX  (via drill 0.6)
  Top 0.305: J2.3 94.06,32.81 90.98,32.84 83.57,32.84 v82.88,32.87 | v82.88,40.82 59.05,40.82 v58.14,41.68 | v57.58,34.95 57.58,36.62 U11.36
  Bottom 0.305: v82.88,32.87 v82.88,40.82 | v58.14,41.68 58.14,35.66 v57.58,34.95
U1TX  (via drill 0.6)
  Top 0.305: J2.2 81.89,30.27 v81.84,30.22 | v81.56,16.15 70.13,16.15 68.81,15.85 v60.2,15.85 | v59.03,27.66 60.85,27.66 U11.24
  Bottom 0.305: v81.84,30.22 81.84,17.22 v81.56,16.15 | v60.2,15.85 60.2,25.78 v59.03,27.66
U2RX  (via drill 0.6)
  Top 0.254: U11.32 59.64,34.11 59.11,33.7 v57.89,32.76 | v62.31,16.99 78.87,16.99 80.11,18.69 88.98,18.69 90.6,20.32 94,20.32 94.84,20.34 95.28,20.34 J3.3
  Bottom 0.254: v57.89,32.76 57.86,28.8 61.04,28.8 61.06,18.95 v62.31,16.99
U2TX  (via drill 0.6)
  Top 0.254: J3.2 86.92,17.75 84.63,14.83 63.45,14.83 v63.4,14.78 | v59,29.95 60.88,30.15 U11.27
  Bottom 0.254: v63.4,14.78 63.4,19.51 61.95,20.95 61.9,29.84 61.57,29.95 v59,29.95
VCC  (via drill 0.6)
  Top 0.305: U6.8 U6.7 U6.6 | U3.8 U3.7 U3.6 94.82,55 C35.1 93.47,56.35 | U10.19 72.02,25.56 73.41,26.49 73.41,28.34 | R5.2 62.34,13.22 61.06,11.66 39.7,11.66 v39.65,11.88
  Top 0.406: U6.8 9.32,57.66 C34.1 | 93.47,56.35 93.47,51.43 v92.69,50.65 | v90.58,46.33 88.21,46.33 v87.3,45.41
  Top 0.61: C30.1 73.41,28.34 75.59,28.34 | 75.59,28.34 75.98,28.34 R6.2 | R5.2 75.75,13.22 77.29,12.06 77.34,12.06 | J1.2 18,58.82 16.13,56.95 10.04,56.95 C34.1 | v84.38,28.45 75.69,28.45 75.59,28.34 | JP1.2 35.79,30.27 34.9,31.16 34.9,32.71 v31.9,33.32 | 77.34,12.06 81.27,12.06 R7.2 R8.2 85.72,13.44 v86.92,14.63 | J13.1 77.34,5.15 77.34,12.06
  Bottom 0.305: v39.65,11.88 39.65,20.09 39.62,20.98 39.62,28.7 JP1.2
  Bottom 0.406: v92.69,50.65 92.08,50.65 90.5,49.07 90.5,46.4 v90.58,46.33
  Bottom 0.61: J7.2 82,53.03 87.3,47.72 v87.3,45.41 87.33,42.42 84.33,39.44 84.33,28.5 v84.38,28.45 83.59,27.66 83.59,19.86 86.92,16.53 v86.92,14.63 | v31.9,33.32 29.23,33.32 27.66,35.58 27.66,43.81 25.68,47.42 25.68,55.98 24.79,56.87 20.23,56.87 18,59.1 J1.2

### Text on the board
tPlace: TWO MOTOR CONTROLLER REV 1.0 | + | + | + | VIN | + | - | + | + | + | U10
tSilk: I2C | UART 1 | UART 2 | SW1 | SENSE1 | SW2 | SENSE2 | IO